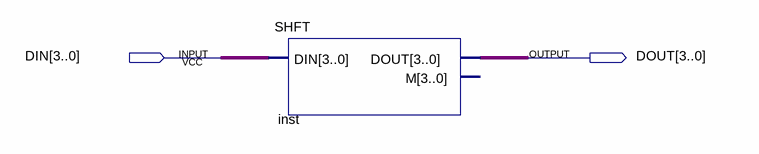
[diagram p0: schematic sheet]
// Quartus schematic shiyan_3.bdf as structural Verilog: 1 symbols, 2 pins
module shiyan_3 (
  input  [3:0] DIN,
  output [3:0] DOUT
);

  SHFT inst (.DIN(DIN), .DOUT(DOUT));  // open: M
endmodule
